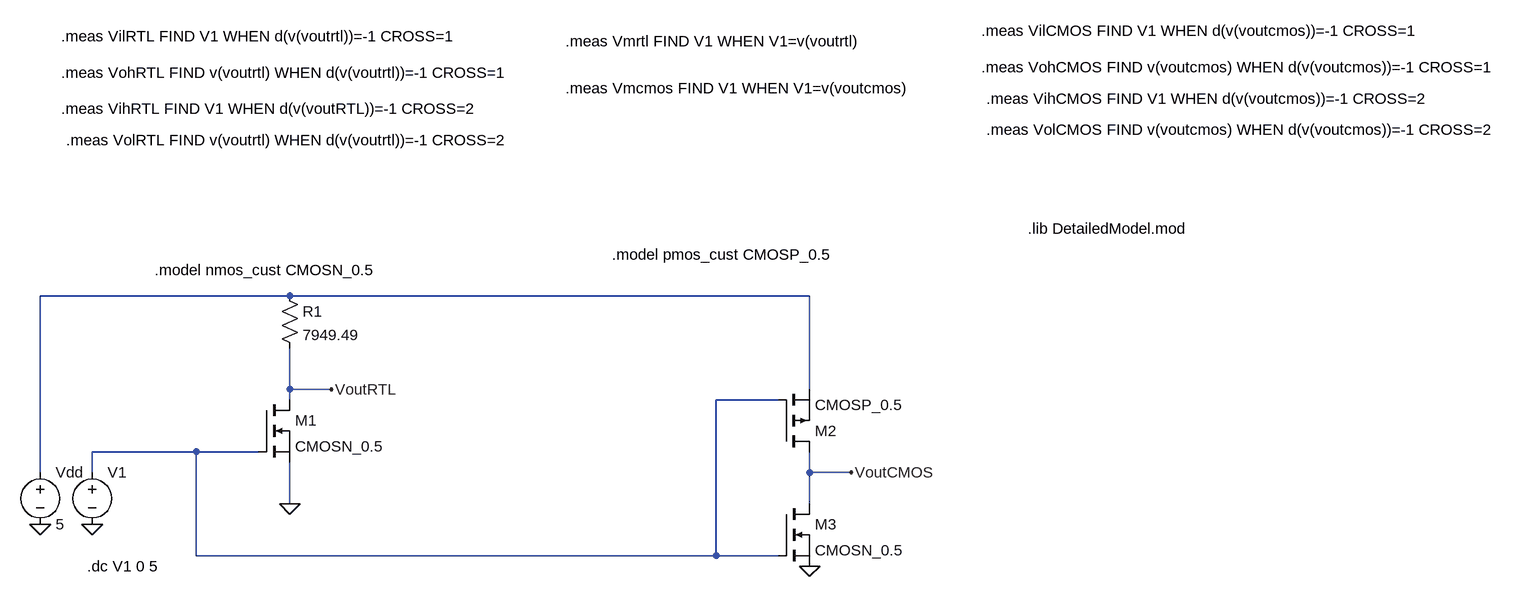
[diagram p0: schematic inverterComparison.asc]
inverterComparison.asc, the LTspice schematic file:
Version 4
SHEET 1 2044 680
WIRE 144 -80 -240 -80
WIRE 944 -80 144 -80
WIRE 144 64 144 0
WIRE 208 64 144 64
WIRE 944 64 944 -80
WIRE 144 80 144 64
WIRE 896 80 800 80
WIRE 0 160 -160 160
WIRE 96 160 0 160
WIRE -240 192 -240 -80
WIRE -160 192 -160 160
WIRE 944 192 944 160
WIRE 1008 192 944 192
WIRE 144 240 144 176
WIRE 944 240 944 192
WIRE 0 320 0 160
WIRE 800 320 800 80
WIRE 800 320 0 320
WIRE 896 320 800 320
FLAG 208 64 VoutRTL
FLAG 144 240 0
FLAG -240 272 0
FLAG -160 272 0
FLAG 944 336 0
FLAG 1008 192 VoutCMOS
SYMBOL nmos 96 80 R0
SYMATTR InstName M1
SYMATTR Value CMOSN_0.5
SYMBOL pmos 896 160 M180
SYMATTR InstName M2
SYMATTR Value CMOSP_0.5
SYMBOL res 128 -96 R0
SYMATTR InstName R1
SYMATTR Value 7949.49
SYMBOL voltage -160 176 R0
SYMATTR InstName V1
SYMATTR Value ""
SYMBOL voltage -240 176 R0
SYMATTR InstName Vdd
SYMATTR Value 5
SYMBOL nmos 896 240 R0
SYMATTR InstName M3
SYMATTR Value CMOSN_0.5
TEXT -168 336 Left 2 !.dc V1 0 5
TEXT -64 -120 Left 2 !.model nmos_cust CMOSN_0.5
TEXT 640 -144 Left 2 !.model pmos_cust CMOSP_0.5
TEXT 1208 -488 Left 2 !.meas VilCMOS FIND V1 WHEN d(v(voutcmos))=-1 CROSS=1
TEXT 568 -400 Left 2 !.meas Vmcmos FIND V1 WHEN V1=v(voutcmos)
TEXT 568 -472 Left 2 !.meas Vmrtl FIND V1 WHEN V1=v(voutrtl)
TEXT 1208 -432 Left 2 !.meas VohCMOS FIND v(voutcmos) WHEN d(v(voutcmos))=-1 CROSS=1
TEXT 1216 -384 Left 2 !.meas VihCMOS FIND V1 WHEN d(v(voutcmos))=-1 CROSS=2
TEXT 1216 -336 Left 2 !.meas VolCMOS FIND v(voutcmos) WHEN d(v(voutcmos))=-1 CROSS=2
TEXT -208 -480 Left 2 !.meas VilRTL FIND V1 WHEN d(v(voutrtl))=-1 CROSS=1
TEXT -208 -424 Left 2 !.meas VohRTL FIND v(voutrtl) WHEN d(v(voutrtl))=-1 CROSS=1
TEXT -208 -368 Left 2 !.meas VihRTL FIND V1 WHEN d(v(voutRTL))=-1 CROSS=2
TEXT -200 -320 Left 2 !.meas VolRTL FIND v(voutrtl) WHEN d(v(voutrtl))=-1 CROSS=2
TEXT 1280 -184 Left 2 !.lib DetailedModel.mod

The netlist it stands for:
* inverterComparison.asc
M1 VoutRTL N002 0 0 CMOSN_0.5
M2 VoutCMOS N002 N001 N001 CMOSP_0.5
R1 N001 VoutRTL 7949.49
V1 N002 0
Vdd N001 0 5
M3 VoutCMOS N002 0 0 CMOSN_0.5
.model NMOS NMOS
.model PMOS PMOS
.lib standard.mos
.dc V1 0 5
.model nmos_cust CMOSN_0.5
.model pmos_cust CMOSP_0.5
.meas VilCMOS FIND V1 WHEN d(v(voutcmos))=-1 CROSS=1
.meas Vmcmos FIND V1 WHEN V1=v(voutcmos)
.meas Vmrtl FIND V1 WHEN V1=v(voutrtl)
.meas VohCMOS FIND v(voutcmos) WHEN d(v(voutcmos))=-1 CROSS=1
.meas VihCMOS FIND V1 WHEN d(v(voutcmos))=-1 CROSS=2
.meas VolCMOS FIND v(voutcmos) WHEN d(v(voutcmos))=-1 CROSS=2
.meas VilRTL FIND V1 WHEN d(v(voutrtl))=-1 CROSS=1
.meas VohRTL FIND v(voutrtl) WHEN d(v(voutrtl))=-1 CROSS=1
.meas VihRTL FIND V1 WHEN d(v(voutRTL))=-1 CROSS=2
.meas VolRTL FIND v(voutrtl) WHEN d(v(voutrtl))=-1 CROSS=2
.lib DetailedModel.mod
.backanno
.end

* Results of the author's LTspice run, read from the files saved beside the schematic
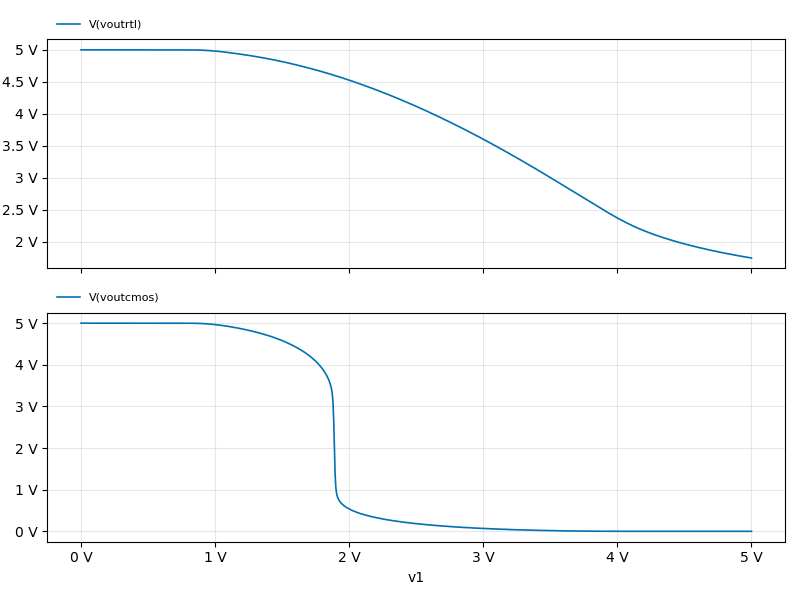
[diagram p1: DC transfer characteristic of inverterComparison.asc, plotted from the saved traces]
* DC transfer characteristic, 1 run:
*   V(voutrtl): 5 V at v1=0 V, 1.749 V at v1=5 V, min 1.749 V, max 5 V
*   V(voutcmos): 5 V at v1=0 V, 15.84 nV at v1=5 V, min 15.84 nV, max 5 V
* From the log:
*   vilcmos: v1=3.09551 at 3.09551
*   vmcmos: v1=3.13485 at 3.13485
*   vmrtl: v1=3.54104 at 3.54104
*   vohcmos: v(voutcmos)=5.96392 at 3.09551
*   vihcmos: v1=3.16813 at 3.16813
*   volcmos: v(voutcmos)=0.0398105 at 3.16813
*   vilrtl: v1=3.0599 at 3.0599
*   vohrtl: v(voutrtl)=5.96985 at 3.0599
*   vihrtl: v1=3.91769 at 3.91769
*   volrtl: v(voutrtl)=0.48665 at 3.91769